# Altium project Gift4XingyuanandJunjie_Project.PrjPcb
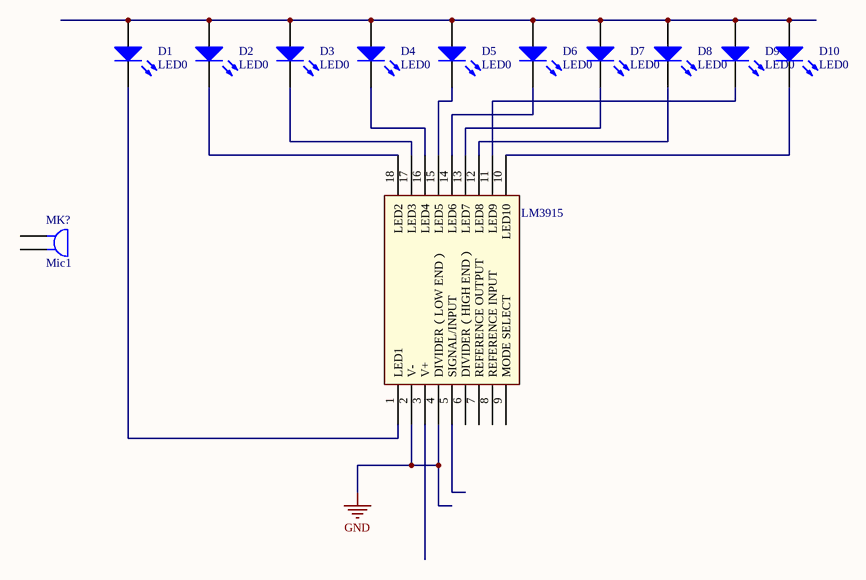
[diagram p0: Sheet1.SchDoc]
1 sheet, 12 parts. Net scope: global (net labels, ports and power ports of the same name join across sheets).
Board file: PCB1.PcbDoc

## Sheet Sheet1.SchDoc
size A4

### Parts
D1  LED0  [LED-0]
D2  LED0  [LED-0]
D3  LED0  [LED-0]
D4  LED0  [LED-0]
D5  LED0  [LED-0]
D6  LED0  [LED-0]
D7  LED0  [LED-0]
D8  LED0  [LED-0]
D9  LED0  [LED-0]
D10  LED0  [LED-0]
LM3915  LM3915  [LM3915]
MK?  Mic1  [PIN2]

### Nets
GND: LM3915.2(V-) LM3915.4(DIVIDER（LOW_END）)
NetD1_1: D1.1(A) D2.1(A) D3.1(A) D4.1(A) D5.1(A) D6.1(A) D7.1(A) D8.1(A) D9.1(A) D10.1(A)
NetD1_2: D1.2(K) LM3915.1(LED1)
NetD2_2: D2.2(K) LM3915.18(LED2)
NetD3_2: D3.2(K) LM3915.17(LED3)
NetD4_2: D4.2(K) LM3915.16(LED4)
NetD5_2: D5.2(K) LM3915.15(LED5)
NetD6_2: D6.2(K) LM3915.14(LED6)
NetD7_2: D7.2(K) LM3915.13(LED7)
NetD8_2: D8.2(K) LM3915.12(LED8)
NetD9_2: D9.2(K) LM3915.11(LED9)
NetD10_2: D10.2(K) LM3915.10(LED10)

Not connected (* = marked no-connect by the designer): LM3915 3(V+) 5(SIGNAL/INPUT) 6(DIVIDER（HIGH_END）) 7(REFERENCE_OUTPUT) 8(REFERENCE_INPUT) 9(MODE_SELECT); MK? 1 2

### Library data of the parts
D1-D10 = LED0: Typical INFRARED GaAs LED; Published: 8-Jun-2000; LatestRevisionDate: 08-Jul-2005; LatestRevisionNote: Mech Layer 1 removed.; PackageReference: LED-0; Publisher: Altium Limited; PackageDescription: LED; 2 Leads
LM3915 = LM3915: 一款可以控制10个LED灯的电平IC
MK? = Mic1: Microphone; Published: 24-Mar-1999; LatestRevisionDate: 17-Jul-2002; LatestRevisionNote: Re-released for DXP Platform.; PackageReference: PIN2; Publisher: Altium Limited